# EAGLE design Wii U TS Breakout (EAGLE 6.6.0)
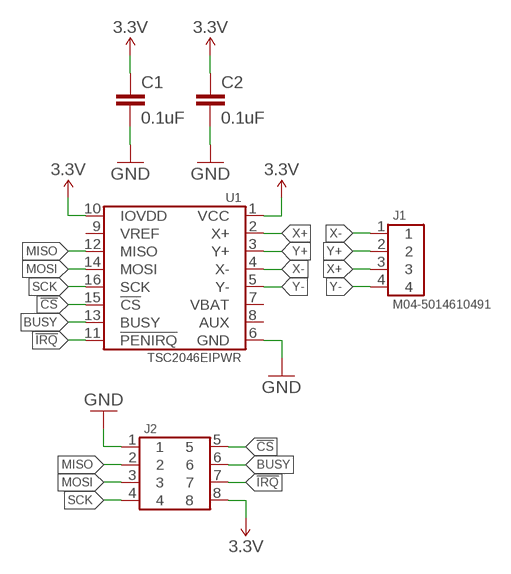
[diagram p0: schematic, sheet 1]

## Parts
C1  0.1uF  CAP-0603  [0603-CAP]
C2  0.1uF  CAP-0603  [0603-CAP]
J1  M04-5014610491  [5014610491]
J2  M04X2-100MIL  [M04X2-100MIL]
U1  TSC2046EIPWR  [TSSOP-16]

## Nets
3.3V: C1.1 C2.1 J2.8 U1.1(VCC) U1.10(IOVDD)
!CS: J2.5 U1.15(!CS)
!IRQ: J2.7 U1.11(!PENIRQ)
BUSY: J2.6 U1.13(BUSY)
GND: C1.2 C2.2 J2.1 U1.6(GND)
MISO: J2.2 U1.12(MISO)
MOSI: J2.3 U1.14(MOSI)
SCK: J2.4 U1.16(SCK)
X+: J1.3 U1.2(X+)
X-: J1.1 U1.4(X-)
Y+: J1.2 U1.3(Y+)
Y-: J1.4 U1.5(Y-)
Unconnected: U1.7(VBAT) U1.8(AUX) U1.9(VREF)

## Library data of the parts
C1 C2 = Passives:CAP
J1 = Connectors:M04
J2 = Connectors:M04X2
U1 = TI:TSC2046

## Board
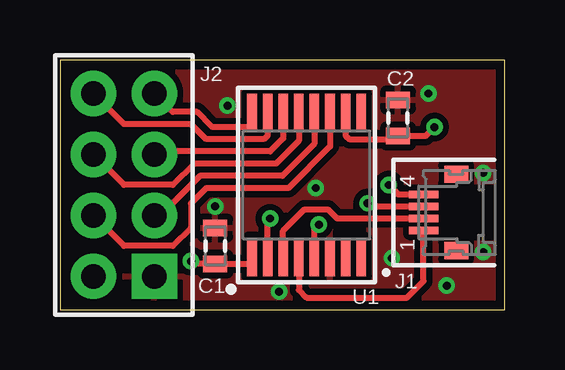
[diagram p1: board, top side]
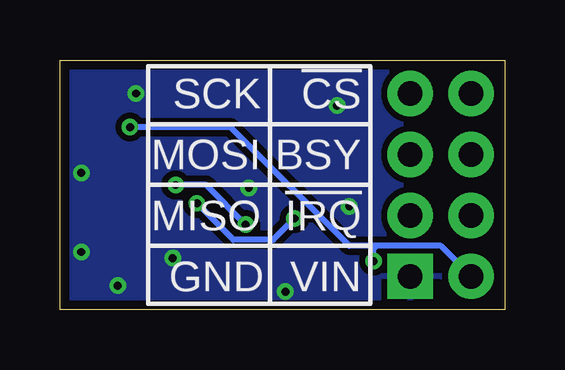
[diagram p2: board, bottom side, seen from below]

Size 18.54 x 10.41 mm. Coordinates in mm from the lower left corner, seen from the top.
Outline: 0,0 18.54,0 18.54,10.41 0,10.41 0,0
Copper layers (1*16): Top 0.0356mm / dielectric 1.5011mm / Bottom 0.0356mm
Design rules "oshpark-2layer *": minimum track width 6mil, minimum drill 13mil, track to track 6mil, track to pad 6mil, pad to pad 6mil, via to via 6mil, smd to smd 6mil, copper to edge 15mil, drill to drill 6mil, minimum pad ring 7mil, minimum via ring 7mil, stop-mask expansion 2.5mil, vias tented up to drill 20mil, thermal gap 10mil

### Footprints (pad centres in the part's own frame; a part is rotated, then mirrored left to right if it is on the bottom)
0603-CAP = smd 0.7 x 1: 1 -0.75,0; 2 0.75,0
5014610491 = smd 0.3 x 1.21: 1 0.75,-2.995; 2 0.25,-2.995; 3 -0.25,-2.995; 4 -0.75,-2.995 | smd 0.72 x 1: P$1 1.59,-1.64; P$2 -1.59,-1.64
M04X2-100MIL = drill 1.016 pad 1.88 square: 1 -3.81,-1.27 | drill 1.016 pad 1.88: 2 -1.27,-1.27; 3 1.27,-1.27; 4 3.81,-1.27; 5 3.81,1.27; 6 1.27,1.27; 7 -1.27,1.27; 8 -3.81,1.27
TSSOP-16 = smd 1.6 x 0.4: 1 -3,2.275; 2 -3,1.625; 3 -3,0.975; 4 -3,0.325; 5 -3,-0.325; 6 -3,-0.975; 7 -3,-1.625; 8 -3,-2.275; 9 3,-2.275; 10 3,-1.625; 11 3,-0.975; 12 3,-0.325; 13 3,0.325; 14 3,0.975; 15 3,1.625; 16 3,2.275

### Placement (x,y rotation side)
C1  6.48,2.67 90 top
C2  14.1,8 90 top
J1  18.16,4.06 270 top
J2  2.67,5.21 90 top
U1  10.29,5.21 90 top

### Tracks (layer width: path | path; a pad name or v marks a point on that pad's centre or on a via)
3.3V  (via drill 0.33)
  Top 0.254: U1.1 8.01,1.92 C1.1 5.58,1.92 v5.46,2.03 | U1.10 11.91,7.26 12.06,7.11 13.96,7.11 C2.1 15.24,7.24 v15.62,7.62
  Bottom 0.254: J2.8 2.67,2.67 5.33,2.67 | 5.33,2.67 5.46,2.67 | 5.46,2.67 5.59,2.67 | 5.59,2.67 6.48,2.67 11.43,7.62 v15.62,7.62 | v5.46,2.03 5.46,2.54 | 5.46,2.54 5.46,2.67 | 5.46,2.54 5.33,2.67 | 5.46,2.54 5.59,2.67
!CS
  Top 0.254: U1.15 8.66,7.26 8.51,7.11 6.1,7.11 5.46,7.75 2.67,7.75 J2.5
!IRQ
  Top 0.254: U1.11 11.26,6.82 9.53,5.08 6.1,5.08 5.46,4.45 5.46,3.43 4.7,2.67 2.67,2.67 J2.7
BUSY
  Top 0.254: U1.13 9.96,7.04 9.02,6.1 5.59,6.1 4.7,5.21 2.67,5.21 J2.6
GND  (via drill 0.33)
  other vias: 13.84,2.16 6.99,8.51 15.37,9.02 6.48,4.32 9.14,0.76 10.67,5.08 16.13,1.02 17.65,2.41 17.65,5.71
  pour Top (isolate 0.254): -1.27,12.06 19.68,12.06 19.68,-1.27 -1.27,-1.27
  pour Bottom (isolate 0.254): -2.54,13.34 20.95,13.34 20.95,-2.54 -2.54,-2.54
MISO
  Top 0.254: U1.12 10.61,6.93 9.27,5.59 5.84,5.59 4.19,3.94 J2.2
MOSI
  Top 0.254: U1.14 9.31,7.15 8.76,6.6 4.06,6.6 J2.3
SCK
  Top 0.254: U1.16 8.01,7.62 6.35,7.62 5.71,8.26 4.7,8.26 J2.4
X+  (via drill 0.33 pad 0.33)
  Top 0.254: U1.2 8.66,3.71 v8.76,3.81 | v12.83,4.45 12.95,4.32 J1.3
  Bottom 0.254: v8.76,3.81 9.65,2.92 11.3,2.92 v12.83,4.45
X-
  Top 0.254: U1.4 9.96,0.83 10.29,0.51 14.48,0.51 15.17,1.2 J1.1
Y+
  Top 0.254: U1.3 9.31,3.3 10.21,4.19 11.18,4.19 11.55,3.81 J1.2
Y-  (via drill 0.33, 0.33 pad 0.33)
  Top 0.254: U1.5 10.61,3.37 v10.79,3.56 | v13.72,5.21 14.11,4.81 J1.4
  Bottom 0.254: v10.79,3.56 12.45,5.21 v13.72,5.21

### Text on the board
bPlace: !CS | SCK | BSY | MOSI | !IRQ | MISO | VIN | GND